# Altium schematic sheet ADE7753.SchDoc
size A
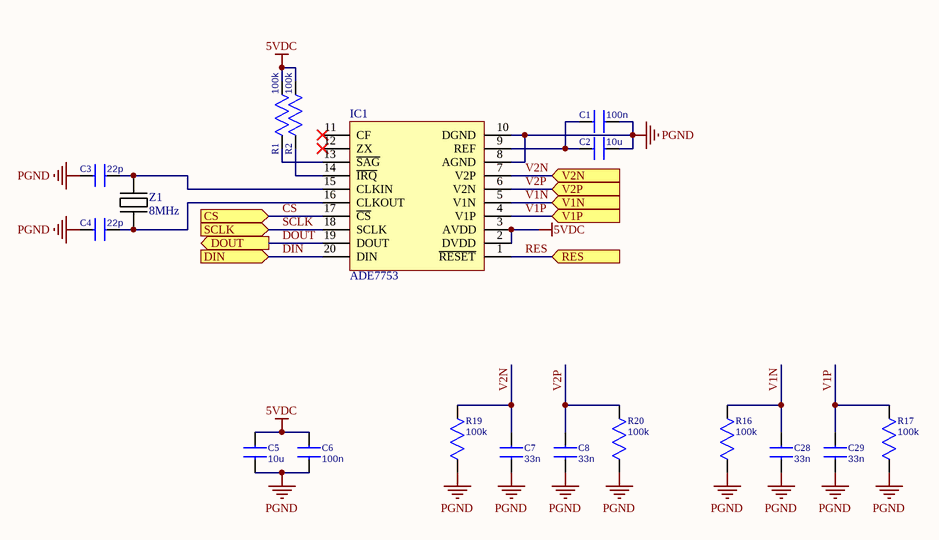
[diagram p0: ADE7753.SchDoc]

## Parts
C1  100n  [C_0603]
C2  10u  [C_0805]
C3  22p  [C_0603]
C4  22p  [C_0603]
C5  10u  [C_0805]
C6  100n  [C_0603]
C7  33n  [C_0603]
C8  33n  [C_0603]
C28  33n  [C_0603]
C29  33n  [C_0603]
IC1  ADE7753  [SOP-20]
R1  100k  [R_0603]
R2  100k  [R_0603]
R16  100k  [R_0603]
R17  100k  [R_0603]
R19  100k  [R_0603]
R20  100k  [R_0603]
Z1  8MHz  [HC-49]

## Ports
CS (in), DIN (in), DOUT (out), RES (in), SCLK (in), V1N (in), V1P (in), V2N (in), V2P (in)

## Nets
5VDC: C5.2 C6.2 IC1.2(DVDD) IC1.3(AVDD) R1.2 R2.2
PGND: C1.2 C2.2 C3.1 C4.1 C5.1 C6.1 C7.1 C8.1 C28.1 C29.1 IC1.8(AGND) IC1.10(DGND) R16.2 R17.2 R19.2 R20.2
CS: IC1.17(~{CS}) ; port CS
DIN: IC1.20(DIN) ; port DIN
DOUT: IC1.19(DOUT) ; port DOUT
RES: IC1.1(~{RESET}) ; port RES
SCLK: IC1.18(SCLK) ; port SCLK
V1N: C28.2 IC1.5(V1N) R16.1 ; port V1N
V1P: C29.2 IC1.4(V1P) R17.1 ; port V1P
V2N: C7.2 IC1.7(V2P) R19.1 ; port V2N
V2P: C8.2 IC1.6(V2N) R20.1 ; port V2P
NetC1_1: C1.1 C2.1 IC1.9(REF)
NetC3_2: C3.2 IC1.15(CLKIN) Z1.2
NetC4_2: C4.2 IC1.16(CLKOUT) Z1.1
NetIC1_13: IC1.13(~{SAG}) R1.1
NetIC1_14: IC1.14(~{IRQ}) R2.1

Not connected (* = marked no-connect by the designer): IC1 11(CF)* 12(ZX)*

## Library data of the parts
C1 C3 C4 C6-C8 C28 C29 = C0603: Capacitor
  C1 C6: Value: 100n
  C3 C4: Value: 22p
  C7 C8 C28 C29: Value: 33n
C2 C5 = C0805: Capacitor; Value: 10u
IC1 = ADE7753ARSZ: Data Acquisition ADC/DAC
R1 R2 R16 R17 R19 R20 = R0603: Resistor; Value: 100k
Z1 = XTAL: Quartz resonator